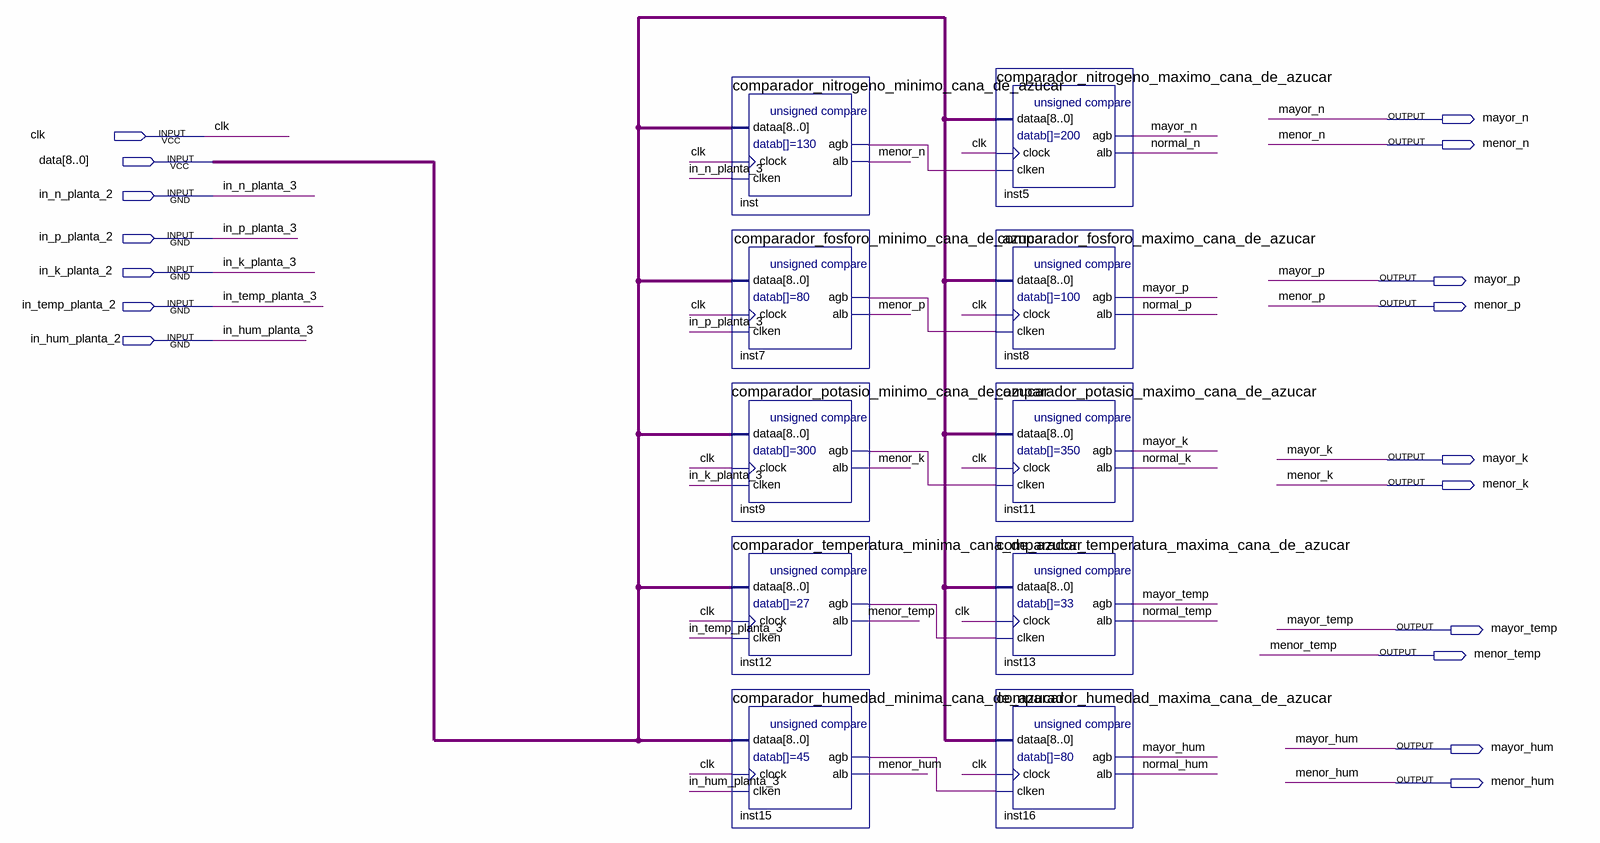
[diagram p0: schematic sheet]
// Quartus schematic Comparador_planta_2.bdf as structural Verilog: 10 symbols, 17 pins
module Comparador_planta_2 (
  input  clk,
  input  [8:0] data,
  input  in_n_planta_2,
  input  in_p_planta_2,
  input  in_k_planta_2,
  input  in_temp_planta_2,
  input  in_hum_planta_2,
  output mayor_n,
  output menor_n,
  output mayor_p,
  output menor_p,
  output mayor_k,
  output menor_k,
  output mayor_temp,
  output menor_temp,
  output mayor_hum,
  output menor_hum
);

  wire inst7_agb, inst9_agb, inst12_agb, inst15_agb, inst_agb, normal_hum, normal_k, normal_n, normal_p,
       normal_temp;

  comparador_nitrogeno_minimo_cana_de_azucar inst (
    .dataa(data), .clock(clk), .clken(in_n_planta_2), .agb(inst_agb), .alb(menor_n));
  comparador_fosforo_minimo_cana_de_azucar inst7 (
    .dataa(data), .clock(clk), .clken(in_p_planta_2), .agb(inst7_agb), .alb(menor_p));
  comparador_potasio_minimo_cana_de_azucar inst9 (
    .dataa(data), .clock(clk), .clken(in_k_planta_2), .agb(inst9_agb), .alb(menor_k));
  comparador_temperatura_minima_cana_de_azucar inst12 (
    .dataa(data), .clock(clk), .clken(in_temp_planta_2), .agb(inst12_agb), .alb(menor_temp));
  comparador_humedad_minima_cana_de_azucar inst15 (
    .dataa(data), .clock(clk), .clken(in_hum_planta_2), .agb(inst15_agb), .alb(menor_hum));
  comparador_nitrogeno_maximo_cana_de_azucar inst5 (
    .dataa(data), .clock(clk), .clken(inst_agb), .agb(mayor_n), .alb(normal_n));
  comparador_fosforo_maximo_cana_de_azucar inst8 (
    .dataa(data), .clock(clk), .clken(inst7_agb), .agb(mayor_p), .alb(normal_p));
  comparador_potasio_maximo_cana_de_azucar inst11 (
    .dataa(data), .clock(clk), .clken(inst9_agb), .agb(mayor_k), .alb(normal_k));
  comparador_temperatura_maxima_cana_de_azucar inst13 (
    .dataa(data), .clock(clk), .clken(inst12_agb), .agb(mayor_temp), .alb(normal_temp));
  comparador_humedad_maxima_cana_de_azucar inst16 (
    .dataa(data), .clock(clk), .clken(inst15_agb), .agb(mayor_hum), .alb(normal_hum));

  // Other names for the same wires on the sheet: in_hum_planta_3 = in_hum_planta_2; in_k_planta_3 = in_k_planta_2;
  //   in_n_planta_3 = in_n_planta_2; in_p_planta_3 = in_p_planta_2; in_temp_planta_3 = in_temp_planta_2
endmodule
